# EAGLE schematic BaseBoard (EAGLE 6.4)
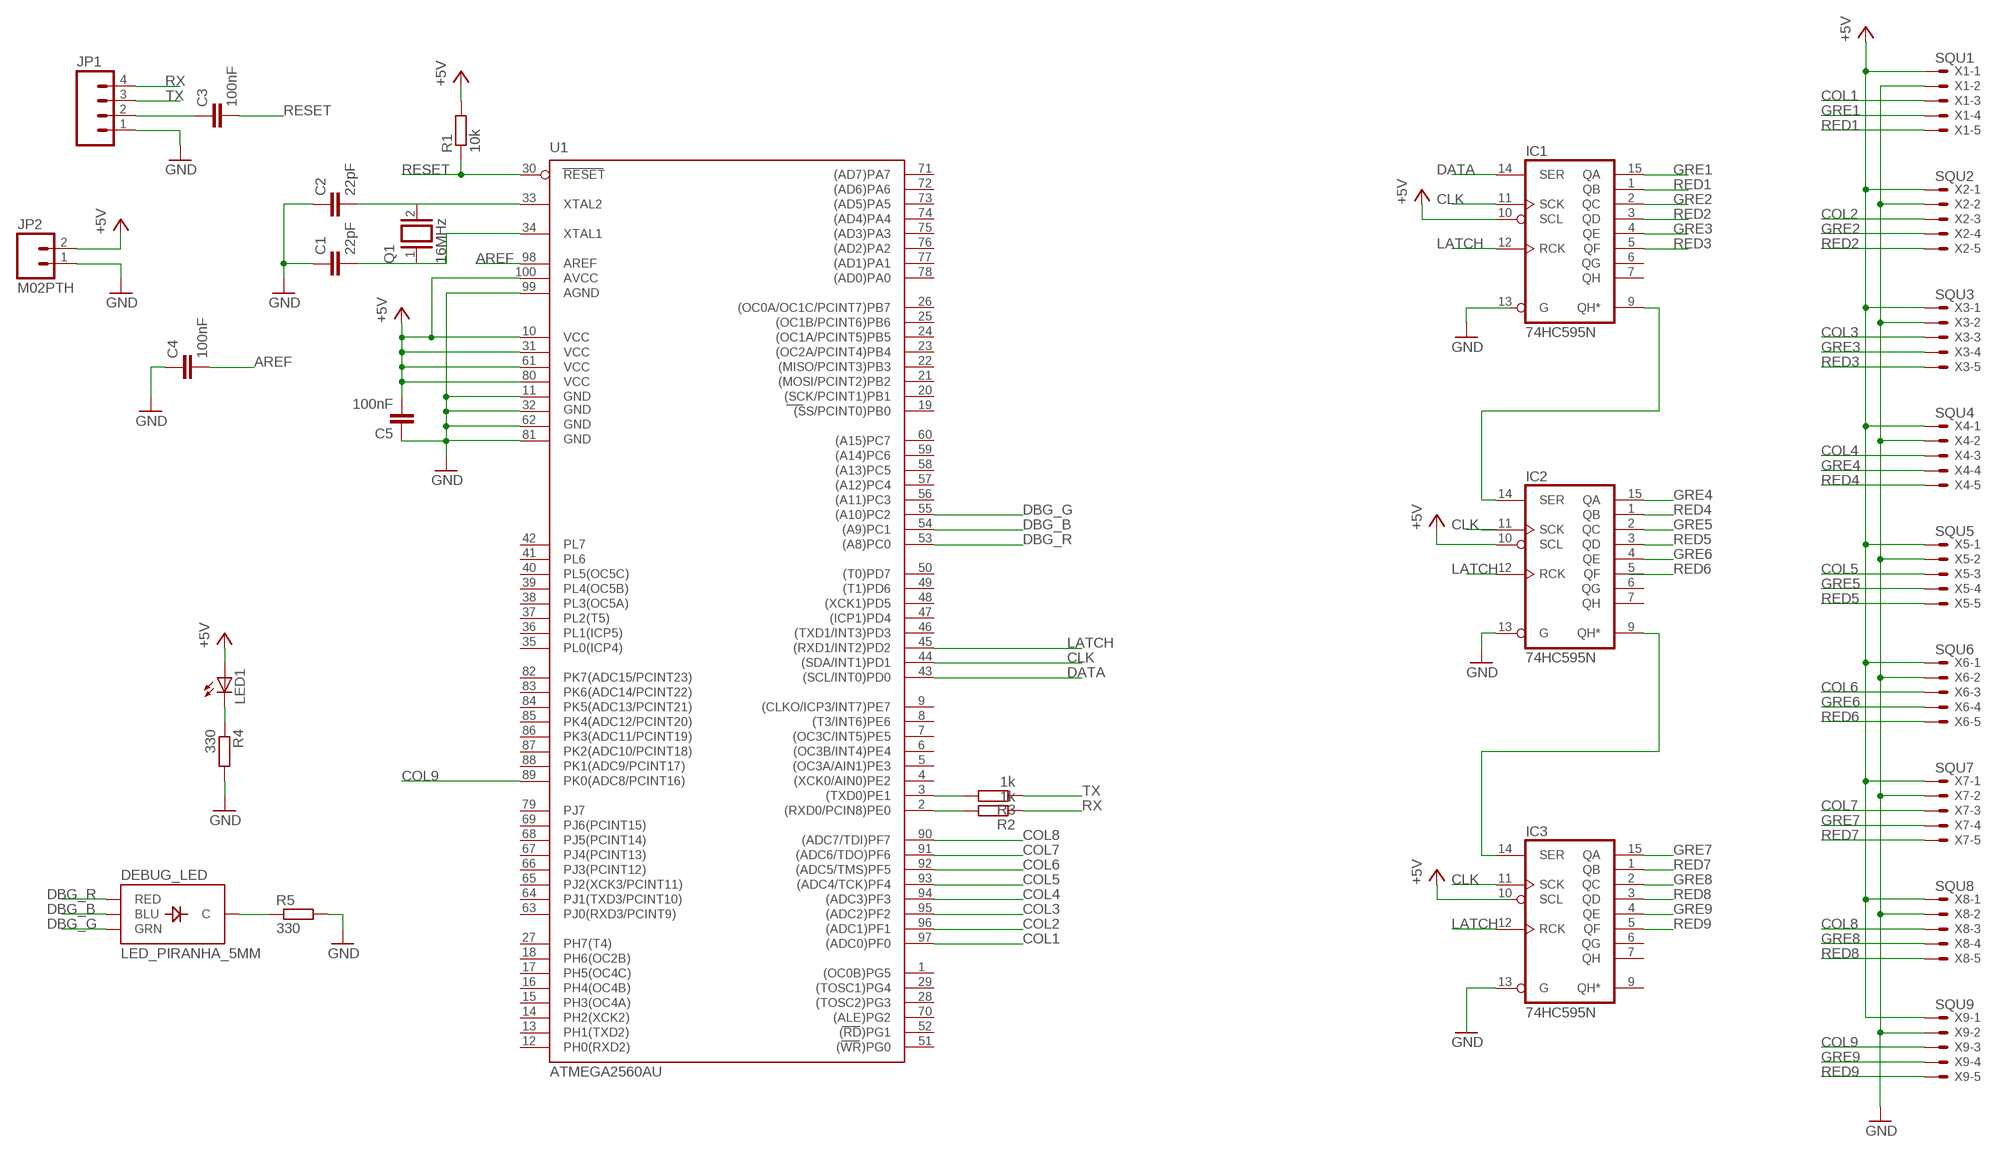
[diagram p0: schematic, sheet 1]

## Parts
C1  22pF  C5/2.5  [C5B2.5]
C2  22pF  C5/2.5  [C5B2.5]
C3  100nF  C5/3  [C5B3]
C4  100nF  C5/3  [C5B3]
C5  100nF  C5/3  [C5B3]
DEBUG_LED  LED_PIRANHA_5MM  [LED_PIRANHA_5MM]
IC1  74HC595N  [DIL16]
IC2  74HC595N  [DIL16]
IC3  74HC595N  [DIL16]
JP1  M04PTH  [1X04]
JP2  M02PTH  [1X02]
LED1  LED3MM  [LED3MM]
Q1  16MHz  XTAL/S  [QS]
R1  10k  R-EU_0204/7  [0204/7]
R2  1k  R-EU_0204/7  [0204/7]
R3  1k  R-EU_0204/7  [0204/7]
R4  330  R-EU_0204/7  [0204/7]
R5  330  R-EU_0204/7  [0204/7]
U1  ATMEGA2560AU  [TQFP100]
X1  SQU1  53261-05  [53261-05]
X2  SQU2  53261-05  [53261-05]
X3  SQU3  53261-05  [53261-05]
X4  SQU4  53261-05  [53261-05]
X5  SQU5  53261-05  [53261-05]
X6  SQU6  53261-05  [53261-05]
X7  SQU7  53261-05  [53261-05]
X8  SQU8  53261-05  [53261-05]
X9  SQU9  53261-05  [53261-05]

## Nets
AREF: C4.2 U1.98(AREF)
CLK: IC1.11(SCK) IC2.11(SCK) IC3.11(SCK) U1.44((SDA/INT1)PD1)
COL1: U1.97((ADC0)PF0) X1.3
COL2: U1.96((ADC1)PF1) X2.3
COL3: U1.95((ADC2)PF2) X3.3
COL4: U1.94((ADC3)PF3) X4.3
COL5: U1.93((ADC4/TCK)PF4) X5.3
COL6: U1.92((ADC5/TMS)PF5) X6.3
COL7: U1.91((ADC6/TDO)PF6) X7.3
COL8: U1.90((ADC7/TDI)PF7) X8.3
COL9: U1.89(PK0(ADC8/PCINT16)) X9.3
DATA: IC1.14(SER) U1.43((SCL/INT0)PD0)
DBG_B: DEBUG_LED.B(BLU) U1.54((A9)PC1)
DBG_G: DEBUG_LED.G(GRN) U1.55((A10)PC2)
DBG_R: DEBUG_LED.R(RED) U1.53((A8)PC0)
GND: C1.1 C2.1 C4.1 C5.1 IC2.13(G) JP1.1 JP2.1 R4.2 R5.2 U1.11(GND) U1.32(GND1) U1.62(GND2) U1.81(GND3) U1.99(AGND) X1.2 X2.2 X3.2 X4.2 X5.2 X6.2 X7.2 X8.2 X9.2
GRE1: IC1.15(QA) X1.4
GRE2: IC1.2(QC) X2.4
GRE3: IC1.4(QE) X3.4
GRE4: IC2.15(QA) X4.4
GRE5: IC2.2(QC) X5.4
GRE6: IC2.4(QE) X6.4
GRE7: IC3.15(QA) X7.4
GRE8: IC3.2(QC) X8.4
GRE9: IC3.4(QE) X9.4
LATCH: IC1.12(RCK) IC2.12(RCK) IC3.12(RCK) U1.45((RXD1/INT2)PD2)
N$1: C2.2 Q1.2 U1.33(XTAL2)
N$2: C1.2 U1.34(XTAL1)
N$3: R3.2 U1.3((TXD0)PE1)
N$4: R2.2 U1.2((RXD0/PCIN8)PE0)
N$5: C3.1 JP1.2
N$6: IC1.9(QH*) IC2.14(SER)
N$7: IC2.9(QH*) IC3.14(SER)
N$8: LED1.K(C) R4.1
N$9: DEBUG_LED.-(C) R5.1
N$28: IC3.13(G)
RED1: IC1.1(QB) X1.5
RED2: IC1.3(QD) X2.5
RED3: IC1.5(QF) X3.5
RED4: IC2.1(QB) X4.5
RED5: IC2.3(QD) X5.5
RED6: X6.5
RED7: IC3.1(QB) X7.5
RED8: IC3.3(QD) X8.5
RED9: IC3.5(QF) X9.5
RESET: C3.2 R1.1 U1.30(RESET)
RX: JP1.4 R2.1
TX: JP1.3 R3.1
VCC: C5.2 IC1.10(SCL) IC2.10(SCL) JP2.2 LED1.A R1.2 U1.10(VCC) U1.31(VCC1) U1.61(VCC2) U1.80(VCC3) U1.100(AVCC) X1.1 X2.1 X3.1 X4.1 X5.1 X6.1 X7.1 X8.1 X9.1 ; supply symbol labelled +5V
Unconnected: IC1.6(QG) IC1.7(QH) IC1.13(G) IC2.5(QF) IC2.6(QG) IC2.7(QH) IC3.6(QG) IC3.7(QH) IC3.9(QH*) IC3.10(SCL) Q1.1 U1.1((OC0B)PG5) U1.4((XCK0/AIN0)PE2) U1.5((OC3A/AIN1)PE3) U1.6((OC3B/INT4)PE4) U1.7((OC3C/INT5)PE5) U1.8((T3/INT6)PE6) U1.9((CLKO/ICP3/INT7)PE7) U1.12(PH0(RXD2)) U1.13(PH1(TXD2)) U1.14(PH2(XCK2)) U1.15(PH3(OC4A)) U1.16(PH4(OC4B)) U1.17(PH5(OC4C)) U1.18(PH6(OC2B)) U1.19((SS/PCINT0)PB0) U1.20((SCK/PCINT1)PB1) U1.21((MOSI/PCINT2)PB2) U1.22((MISO/PCINT3)PB3) U1.23((OC2A/PCINT4)PB4) U1.24((OC1A/PCINT5)PB5) U1.25((OC1B/PCINT6)PB6) U1.26((OC0A/OC1C/PCINT7)PB7) U1.27(PH7(T4)) U1.28((TOSC2)PG3) U1.29((TOSC1)PG4) U1.35(PL0(ICP4)) U1.36(PL1(ICP5)) U1.37(PL2(T5)) U1.38(PL3(OC5A)) U1.39(PL4(OC5B)) U1.40(PL5(OC5C)) U1.41(PL6) U1.42(PL7) U1.46((TXD1/INT3)PD3) U1.47((ICP1)PD4) U1.48((XCK1)PD5) U1.49((T1)PD6) U1.50((T0)PD7) U1.51((WR)PG0) U1.52((RD)PG1) U1.56((A11)PC3) U1.57((A12)PC4) U1.58((A13)PC5) U1.59((A14)PC6) U1.60((A15)PC7) U1.63(PJ0(RXD3/PCINT9)) U1.64(PJ1(TXD3/PCINT10)) U1.65(PJ2(XCK3/PCINT11)) U1.66(PJ3(PCINT12)) U1.67(PJ4(PCINT13)) U1.68(PJ5(PCINT14)) U1.69(PJ6(PCINT15)) U1.70((ALE)PG2) U1.71((AD7)PA7) U1.72((AD6)PA6) U1.73((AD5)PA5) U1.74((AD4)PA4) U1.75((AD3)PA3) U1.76((AD2)PA2) U1.77((AD1)PA1) U1.78((AD0)PA0) U1.79(PJ7) U1.82(PK7(ADC15/PCINT23)) U1.83(PK6(ADC14/PCINT22)) U1.84(PK5(ADC13/PCINT21)) U1.85(PK4(ADC12/PCINT20)) U1.86(PK3(ADC11/PCINT19)) U1.87(PK2(ADC10/PCINT18)) U1.88(PK1(ADC9/PCINT17))

## Power pins joined to a net without a drawn wire
GND: IC1.8(GND) IC2.8(GND) IC3.8(GND)
VCC: IC1.16(VCC) IC2.16(VCC) IC3.16(VCC)

## Library data of the parts
C1-C5 = capacitor-wima:C: CAPACITOR naming: grid - package width
DEBUG_LED = SparkFun-LED:LED_PIRANHA_5MM: High-brightness RGB through-hole LED, similar to that used in the Shiftbrite
IC1-IC3 = 74xx-eu:74*595: 8-bit SHIFT REGISTER, output latch
JP1 = SparkFun-Connectors:M04: Header 4 Standard 4-pin 0.1" header. Use with straight break away headers (SKU : PRT-00116), right angle break away headers (PRT-00553), swiss pins (PRT-00743), machine pins (PRT-00117), and female headers (PRT-00115). Molex polarized connector foot print use with SKU : PRT-08231 with associated crimp pins and housings. 1MM SMD Version SKU: PRT-10208
JP2 = SparkFun-Connectors:M02: Standard 2-pin 0.1" header. Use with - straight break away headers ( PRT-00116) - right angle break away headers (PRT-00553) - swiss pins (PRT-00743) - machine pins (PRT-00117) - female headers (PRT-00115) Molex polarized connector foot print use with: PRT-08233 with associated crimp pins and housings. 2.54_SCREWTERM for use with PRT-10571. 3.5mm Screw Terminal footprints for PRT-08084 5mm Screw Terminal footprints for use with PRT-08433
LED1 = SparkFun-LED:LED: LEDs Standard schematic elements and footprints for 5mm, 3mm, 1206, and 0603 sized LEDs. 5mm - Spark Fun Electronics SKU : COM-00529 (and others)
Q1 = special:XTAL/S: CRYSTAL
R1-R5 = resistor:R-EU_: RESISTOR, European symbol
U1 = SparkFun-DigitalIC:ATMEGA2560: Atmel 100-pin 8-bit uC 64/128/256 Kbytes FLASH 4 Kbytes EEPROM 8 Kbytes SRAM 86 General Purpose I/O pins 12-channels16-bit PWM 4 x Serial USARTs 16-channels 10-bit A/D
X1-X9 = con-molex:53?-05: CONNECTOR wire to board 1.25 mm (.049 inch) pitch header; OC_FARNELL: 1433644; OC_NEWARK: unknown